# EasyEDA Pro project base_pcb.eprj

# Schematic Schematic1
Board Name: Board1; Create Date: 2026-06-29; Page Name: P1; Project Name: base_pcb; Schematic Name: Schematic1; Update Date: 2026-07-03; Company: EasyEDA.com; Page Size: A4; Version: V1.0
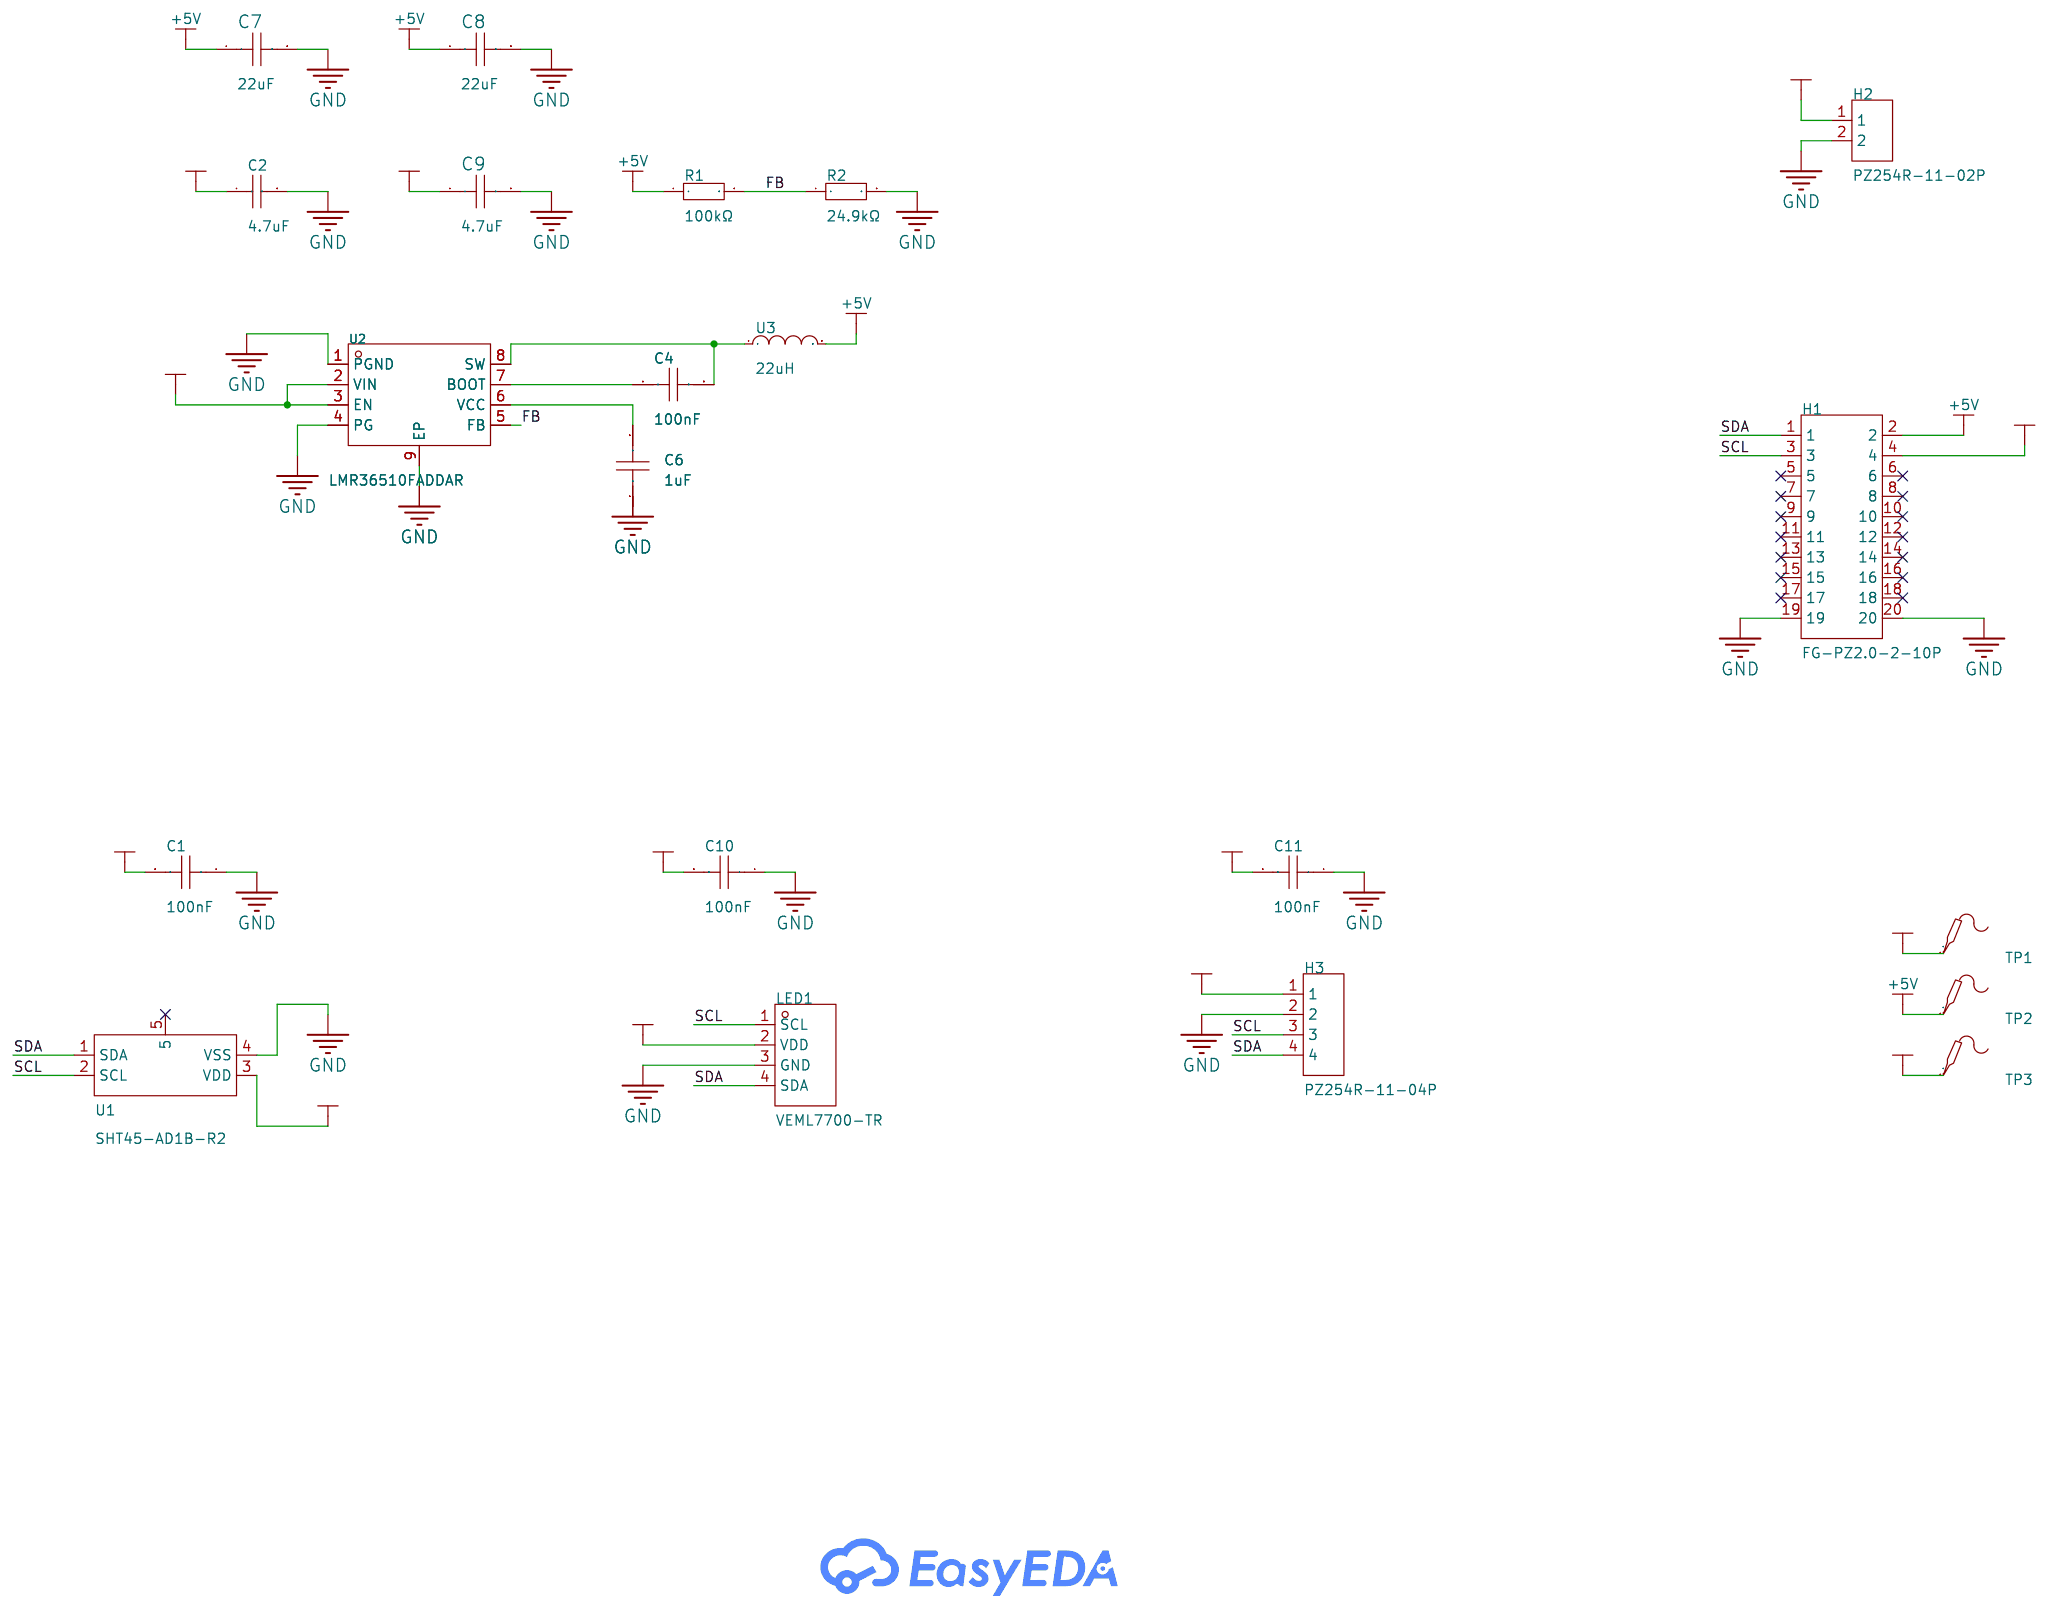
[diagram p0: schematic sheet]

## Parts
C1  100nF  [C0603]
C2  4.7uF  [C1206]
C4  100nF  [C0603]
C6  1uF  [C0603]
C7  22uF  [C1210]
C8  22uF  [C1210]
C9  4.7uF  [C1210]
C10  100nF  [C0603]
C11  100nF  [C0603]
H1  FG-PZ2.0-2-10P  [HDR-TH_20P-P2.00-V-M-R2-C10-S2.0]
H2  PZ254R-11-02P  [HDR-TH_2P-P2.54-H-M-W10.4]
H3  PZ254R-11-04P  [HDR-TH_4P-P2.54-H-M-W10.4]
LED1  VEML7700-TR  [LED-SMD_4P-L6.8-W2.4_VEML7700-TR]
R1  100kΩ  [R0603]
R2  24.9kΩ  [R0603]
TP1  -  [TESTPOINT-TH_TP_4]  (no BOM)
TP2  -  [TESTPOINT-TH_TP_4]  (no BOM)
TP3  -  [TESTPOINT-TH_TP_4]  (no BOM)
U1  SHT45-AD1B-R2  [DFN-4_L1.5-W1.5-P0.8-TL-EP]
U2  LMR36510FADDAR  [ESOP-8_L4.9-W3.9-P1.27-LS6.0-BL-EP-1]
U3  22uH  [IND-SMD_L7.1-W6.6]

## Library data of the parts
C1 C4 C10 C11 = CC0603KRX7R9BB104: Capacitance:100nF Tolerance:±10% Tolerance:±10% Voltage Rating:50V Temperature Coefficient:X7R; LCSC Part Name: 100nF ±10% 50V; Supplier Part: C14663; Manufacturer: YAGEO(国巨); Supplier Footprint: 0603; JLCPCB Part Class: Basic Part; Datasheet: https://item.szlcsc.com/datasheet/CC0603KRX7R9BB104/15331.html; Supplier: LCSC; Tolerance: ±10%; Voltage Rating: 50V; Temperature Coefficient: X7R
C2 = CL31B475KBHNNNE: Capacitance:4.7uF Tolerance:±10% Tolerance:±10% Voltage Rating:50V Temperature Coefficient:X7R; LCSC Part Name: 4.7uF ±10% 50V; Supplier Part: C51205; Manufacturer: SAMSUNG(三星); Supplier Footprint: 1206; JLCPCB Part Class: Extended Part; Datasheet: https://item.szlcsc.com/datasheet/CL31B475KBHNNNE/52218.html; Supplier: LCSC; Tolerance: ±10%; Voltage Rating: 50V; Temperature Coefficient: X7R
C6 = CL10A105KB8NNNC: Capacitance:1uF Tolerance:±10% Tolerance:±10% Voltage Rating:50V Temperature Coefficient:X5R; LCSC Part Name: 1uF ±10% 50V; Supplier Part: C15849; Manufacturer: SAMSUNG(三星); Supplier Footprint: 0603; JLCPCB Part Class: Basic Part; Datasheet: https://item.szlcsc.com/datasheet/CL10A105KB8NNNC/16531.html; Supplier: LCSC; Tolerance: ±10%; Voltage Rating: 50V; Temperature Coefficient: X5R
C7 C8 = GRM32ER71E226KE15L: Capacitance:22uF Tolerance:±10% Tolerance:±10% Voltage Rating:25V Temperature Coefficient:X7R; LCSC Part Name: 22uF ±10% 25V; Supplier Part: C21397; Manufacturer: muRata(村田); Supplier Footprint: 1210; JLCPCB Part Class: Extended Part; Datasheet: https://item.szlcsc.com/datasheet/GRM32ER71E226KE15L/22114.html; Supplier: LCSC; Tolerance: ±10%; Voltage Rating: 25V; Temperature Coefficient: X7R
C9 = GRM32ER71H475KA88L: Capacitance:4.7uF Tolerance:±10% Tolerance:±10% Voltage Rating:50V Temperature Coefficient:X7R; LCSC Part Name: 4.7uF ±10% 50V; Supplier Part: C86052; Manufacturer: muRata(村田); Supplier Footprint: 1210; JLCPCB Part Class: Extended Part; Datasheet: https://item.szlcsc.com/datasheet/GRM32ER71H475KA88L/87228.html; Supplier: LCSC; Tolerance: ±10%; Voltage Rating: 50V; Temperature Coefficient: X7R
H1 = FG-PZ2.0-2-10P: Pin Structure:2x10P Pitch:2mm Row Spacing:2mm Circluar Pins/Square Pins:Pin Header Mounting Type:Through Hole Number of Rows:2 Number of Pins:20P Length of Mating Pin:4mm Insulation Height:2mm Length of End Connection Pin:3mm Contact Material:Brass Contac; LCSC Part Name: 2x10P 间距:2mm 方针 直插; Supplier Part: C42416889; Manufacturer: FG(富港); Supplier Footprint: 插件,P=2mm; Datasheet: https://item.szlcsc.com/datasheet/FG-PZ2.0-2-10P/44419001.html; Supplier: LCSC; Pin Structure: 2x10P; Pitch: 2mm; Row Spacing: 2mm; Circluar Pins/Square Pins: Pin Header; Mounting Type: Through Hole; Number of Rows: 2; Number of Pins: 20P; Length of Mating Pin: 4mm; Insulation Height: 2mm; Length of End Connection Pin: 3mm; Contact Material: Brass; Contact Plating: Gold; Color: Black
H2 = PZ254R-11-02P: Pin Structure:1x2P Pitch:2.54mm Row Spacing:- Circluar Pins/Square Pins:Pin Header Mounting Type:Right Angle Number of Rows:1 Number of Pins:2P Current Rating:3A Voltage Rating (Max):250V Length of Mating Pin:6mm Insulation Height:2.5mm Length of End Conn; LCSC Part Name: 1x2P 间距:2.54mm 方针 弯插; Supplier Part: C492410; Manufacturer: XFCN(兴飞); Supplier Footprint: 弯插,P=2.54mm; JLCPCB Part Class: Extended Part; Datasheet: https://item.szlcsc.com/datasheet/PZ254R-11-02P/502966.html; Supplier: LCSC; Pin Structure: 1x2P; Pitch: 2.54mm; Circluar Pins/Square Pins: Pin Header; Mounting Type: Right Angle; Number of Rows: 1; Number of Pins: 2P; Current Rating: 3A; Voltage Rating (Max): 250V; Length of Mating Pin: 6mm; Insulation Height: 2.5mm; Contact Material: Brass; Operating Temperature: -40℃~+105℃; Color: Black
H3 = PZ254R-11-04P: LCSC Part Name: 1x4P 间距:2.54mm 方针 弯插; Supplier Part: C492412; Manufacturer: XFCN(兴飞); Supplier Footprint: 弯插,P=2.54mm; JLCPCB Part Class: Extended Part; Datasheet: https://item.szlcsc.com/datasheet/PZ254R-11-04P/502968.html; Supplier: LCSC; Pin Structure: 1x4P; Pitch: 2.54mm; Circluar Pins/Square Pins: Pin Header; Mounting Type: Right Angle; Number of Rows: 1; Number of Pins: 4P; Current Rating: 3A; Voltage Rating (Max): 250V; Length of Mating Pin: 6mm; Insulation Height: 2.5mm; Contact Material: Brass; Operating Temperature: -40℃~+105℃; Color: Black
LED1 = VEML7700-TR: LCSC Part Name: I2C接口的高精度环境光传感器; Supplier Part: C504893; Manufacturer: VISHAY(威世); Supplier Footprint: SMD-4P; JLCPCB Part Class: Extended Part; Datasheet: https://item.szlcsc.com/datasheet/VEML7700-TR/519982.html; Supplier: LCSC; Measurement Type: Light Intensity; Photoperceptivity: 120klx; Interface: I2C; Resolution(Bits): 16bit; Voltage - Supply: 2.5V~3.6V; Operating Temperature: -25℃~+85℃; Length: 6.8mm; Width: 2.35mm; Height: 3mm
R1 = 0603WAF1003T5E: Type:Thick Film Resistor Resistance:100kΩ Tolerance:±1% Tolerance:±1% Power(Watts):100mW Voltage-Supply(Max):75V Temperature Coefficient:±100ppm/℃ Temperature Coefficient:±100ppm/℃ Operating Temperature:-55℃~+155℃ Operating Temperature:-55℃~+155℃; LCSC Part Name: 100kΩ ±1% 100mW 厚膜电阻; Supplier Part: C25803; Manufacturer: UNI-ROYAL(厚声); Supplier Footprint: 0603; JLCPCB Part Class: Basic Part; Datasheet: https://item.szlcsc.com/datasheet/0603WAF1003T5E/26546.html; Supplier: LCSC; Type: Thick Film Resistor; Tolerance: ±1%; Power(Watts): 100mW; Voltage-Supply(Max): 75V; Temperature Coefficient: ±100ppm/℃; Operating Temperature: -55℃~+155℃
R2 = 0603WAF2492T5E: Type:Thick Film Resistor Resistance:24.9kΩ Tolerance:±1% Tolerance:±1% Power(Watts):100mW Voltage-Supply(Max):75V Temperature Coefficient:±100ppm/℃ Temperature Coefficient:±100ppm/℃ Operating Temperature:-55℃~+155℃ Operating Temperature:-55℃~+155℃; LCSC Part Name: 24.9kΩ ±1% 100mW 厚膜电阻; Supplier Part: C25962; Manufacturer: UNI-ROYAL(厚声); Supplier Footprint: 0603; JLCPCB Part Class: Extended Part; Datasheet: https://item.szlcsc.com/datasheet/0603WAF2492T5E/26705.html; Supplier: LCSC; Type: Thick Film Resistor; Tolerance: ±1%; Power(Watts): 100mW; Voltage-Supply(Max): 75V; Temperature Coefficient: ±100ppm/℃; Operating Temperature: -55℃~+155℃
TP1-TP3 = Test-Point: Check: false
U1 = SHT45-AD1B-R2: Detection Temperature Range:-40℃~+125℃ Detection Temperature Range:-40℃~+125℃ Tolerance:±0.1℃ Tolerance:±0.1℃ Voltage - Supply:1.08V~3.6V Voltage - Supply:1.08V~3.6V Standby Current:1uA Interface:I2C Temperature Conversion Time:8.3ms Temperature Resolutio; LCSC Part Name: 3.000.645 3.000.645 ±1.0% RH / ±0.1 °C 的数字式温湿度传感器; Supplier Part: C5221601; Manufacturer: Sensirion(瑞士盛思锐); Supplier Footprint: DFN-4(1.5x1.5); JLCPCB Part Class: Extended Part; Datasheet: https://item.szlcsc.com/datasheet/SHT45-AD1B-R2/5920594.html; Supplier: LCSC; Detection Temperature Range: -40℃~+125℃; Tolerance: ±0.1℃; Voltage - Supply: 1.08V~3.6V; Standby Current: 1uA; Interface: I2C; Temperature Conversion Time: 8.3ms; Temperature Resolution: 16bit; Features: Factory temperature calibration
U2 = LMR36510FADDAR: Function:Step-down type Voltage - Supply:4.2V~65V Voltage - Supply:4.2V~65V Output Voltage:1V~28V Output Voltage:1V~28V Output Current:1A Frequency - Switching:400kHz Frequency - Switching:400kHz Operating Temperature:-40℃~+125℃@(TJ) Operating Temperature; LCSC Part Name: 降压型 1A 4.2V~65V; Supplier Part: C1858394; Manufacturer: TI(德州仪器); Supplier Footprint: ESOP-8; JLCPCB Part Class: Extended Part; Datasheet: https://www.ti.com/cn/lit/ds/symlink/lmr36510.pdf; Supplier: LCSC; Function: Step-down type; Voltage - Supply: 4.2V~65V; Output Voltage: 1V~28V; Output Current: 1A; Frequency - Switching: 400kHz; Operating Temperature: -40℃~+125℃@(TJ); Synchronous Rectifier: Yes; Number of Outputs: 1; Topology: Buck; Quiescent Current: 26uA; Switch tube (built-in/external): Built-in; Output Type: Adjustable; Features: Light load efficient mode；Built-in LDO regulator；Cycle-by-cycle current limiting；Operating status indication；Hiccup current limiting
U3 = APH0630T220M: Inductance:22uH Tolerance:±20% Tolerance:±20% Current Rating:2.5A Current - Saturation(Isat):3A DC Resistance(DCR):170mΩ Type:Molded Inductor Ratings:-; LCSC Part Name: 22uH ±20% 3A; Supplier Part: C5349702; Manufacturer: APV(爱普微); Supplier Footprint: SMD,7x6.6mm; JLCPCB Part Class: Extended Part; Datasheet: https://item.szlcsc.com/datasheet/APH0630T220M/6135117.html; Supplier: LCSC; Tolerance: ±20%; Current Rating: 2.5A; Current - Saturation(Isat): 3A; DC Resistance(DCR): 170mΩ; Type: Molded Inductor

## Nets
3V3: C1.2 C10.2 C11.2 H1.4 H3.1 LED1.2(VDD) TP3.1 U1.3(VDD)
+5V: C7.1 C8.1 H1.2 R1.1 TP2.1 U3.2
+24V: C2.1 C9.1 H2.1 TP1.1 U2.2(VIN) U2.3(EN)
GND: C1.1 C2.2 C6.1 C7.2 C8.2 C9.2 C10.1 C11.1 H1.19 H1.20 H2.2 H3.2 LED1.3(GND) R2.2 U1.4(VSS) U2.1(PGND) U2.4(PG) U2.9(EP)
FB: R1.2 R2.1 U2.5(FB)
SCL: H1.3 H3.3 LED1.1(SCL) U1.2(SCL)
SDA: H1.1 H3.4 LED1.4(SDA) U1.1(SDA)
$1N2931: C4.2 U2.8(SW) U3.1
$1N3165: C4.1 U2.7(BOOT)
$1N3213: C6.2 U2.6(VCC)

Not connected (* = marked no-connect by the designer): H1 5* 6* 7* 8* 9* 10* 11* 12* 13* 14* 15* 16* 17* 18*; U1 5*

# Board PCB1
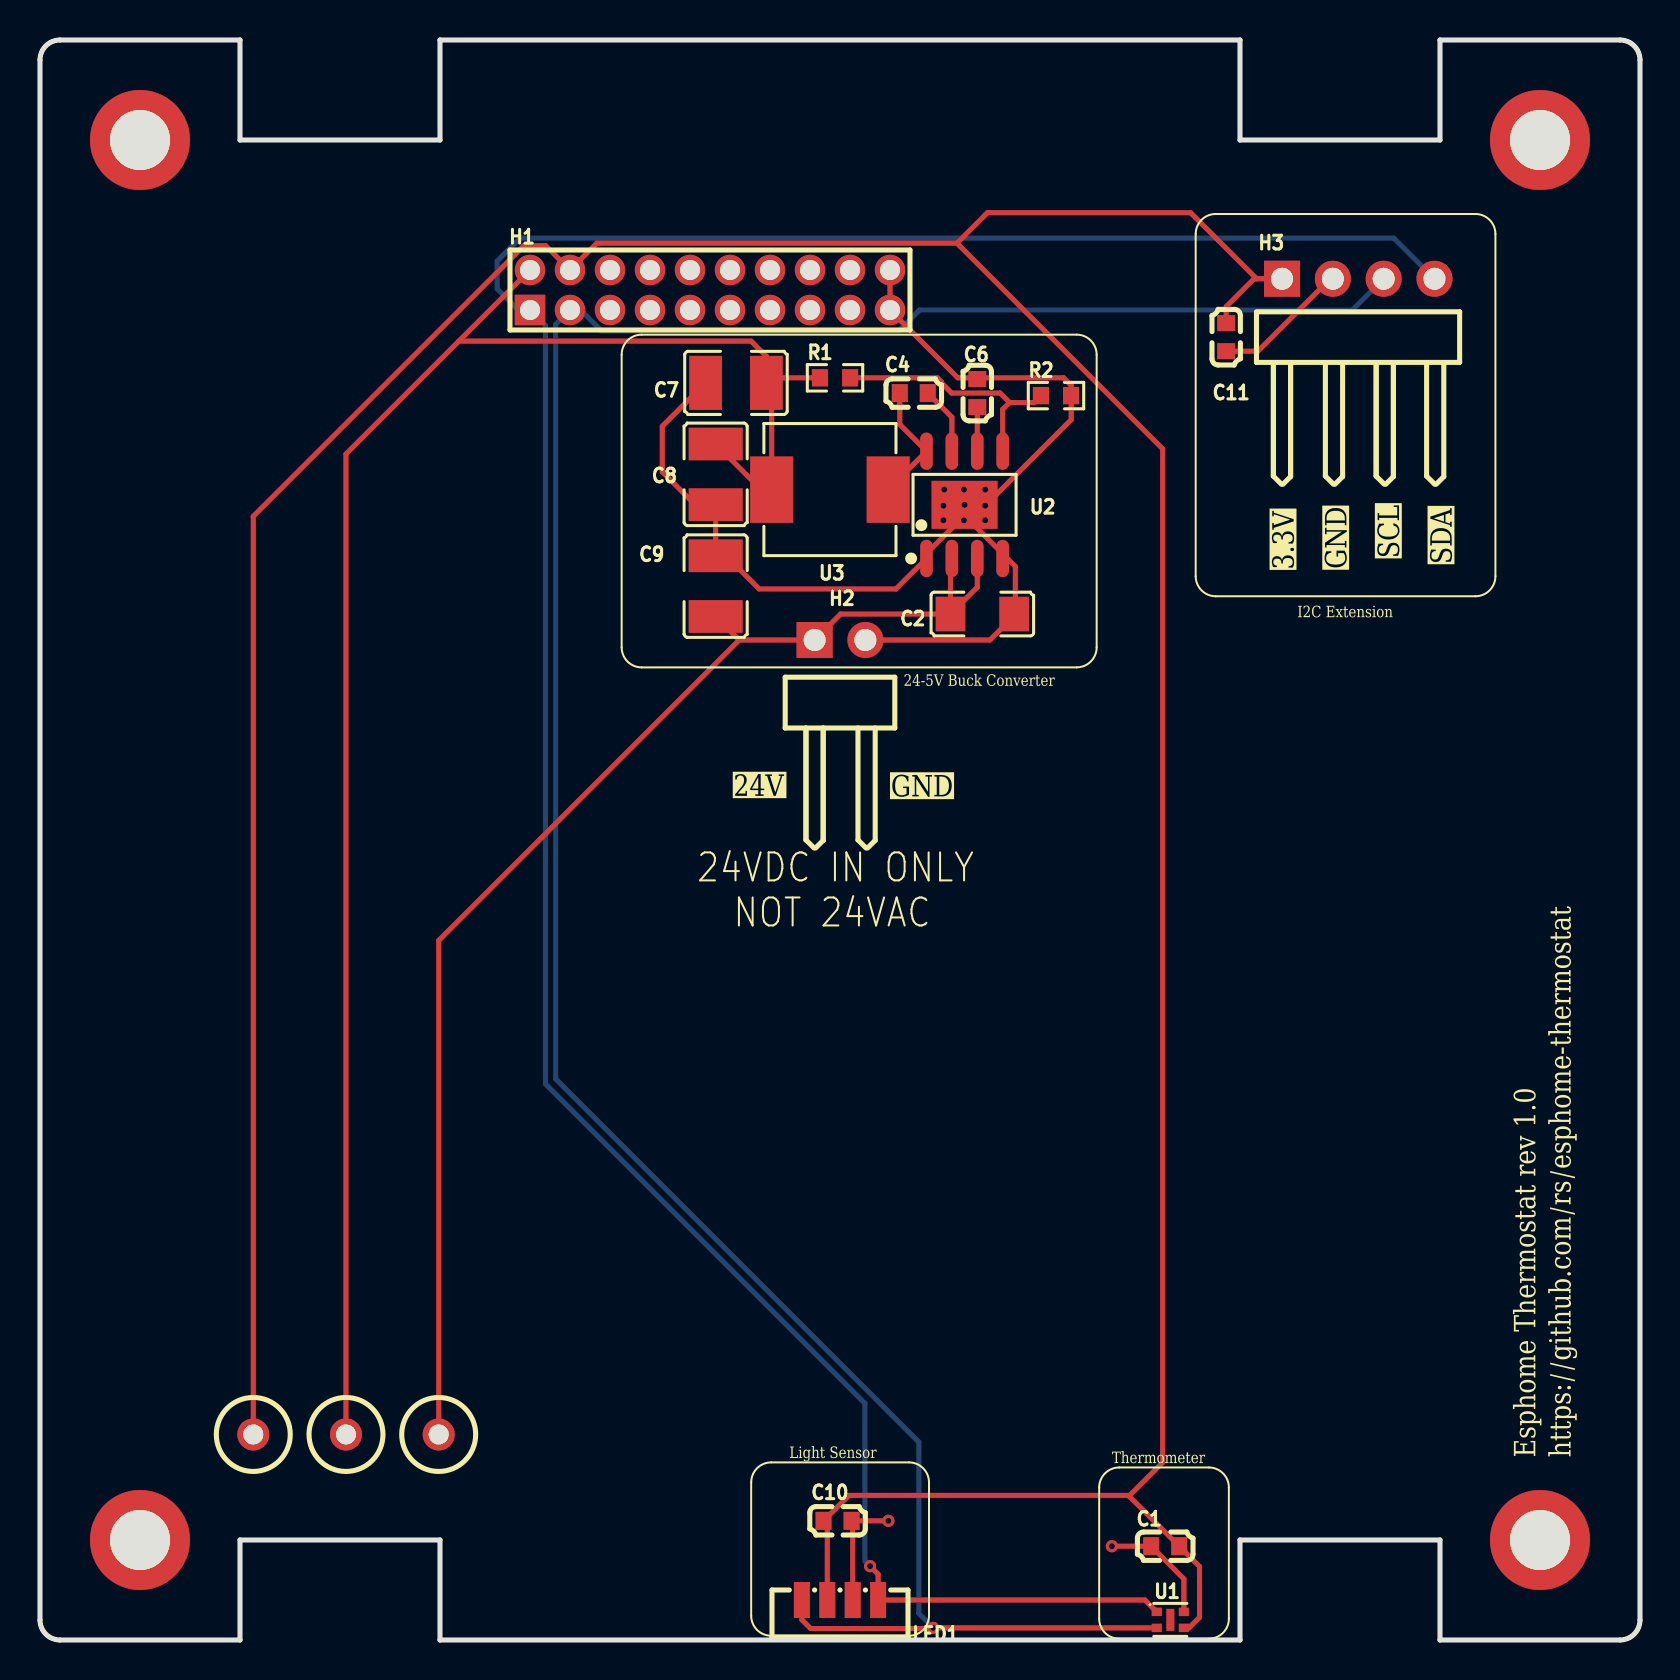
[diagram p1: board, top side]
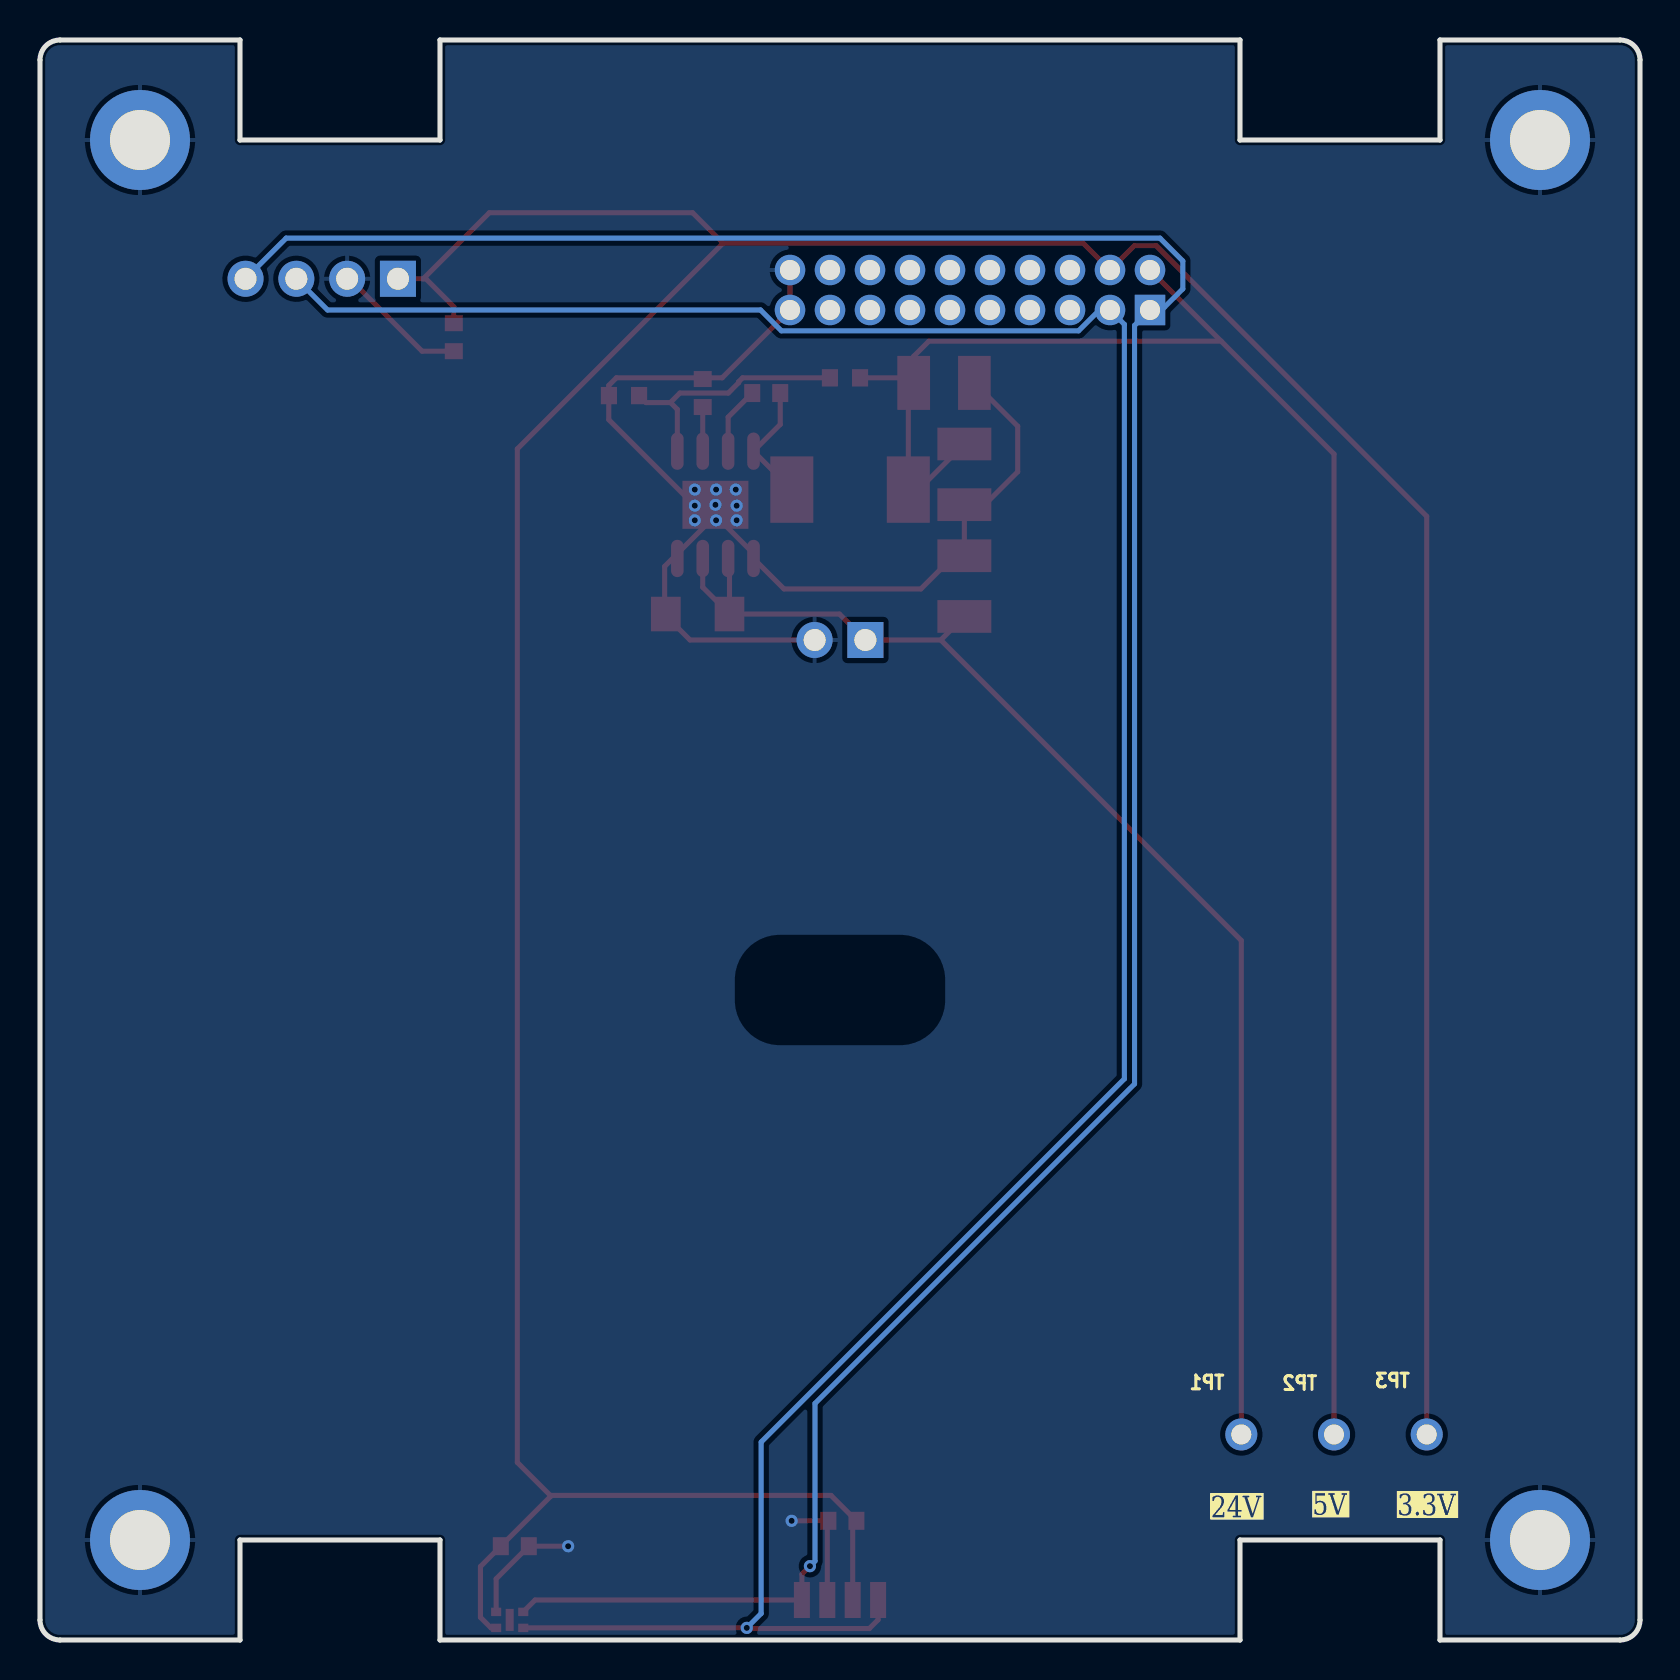
[diagram p2: board, bottom side, seen from below]

Outline 80 x 80 mm; copper layers: Top Layer, Bottom Layer. Coordinates in mm from the lower left corner of the outline.
Outline path: 0,79 0,1 arc(0.29,0.29) 1,0 10,0 10,5 20,5 20,0 60,0 60,5 70,5 70,0 79,0 arc(79.71,0.29) 80,1 80,79 arc(79.71,79.71) 79,80 70,80 70,75 60,75 60,80 20,80 20,75 10,75 10,80 1,80 arc(0.29,79.71) 0,79
Stack: Top Layer 0.035mm / Dielectric1 1.51mm FR4 er 4.5 / Bottom Layer 0.035mm

## Design rules (mm)
template: JLCPCB Capability(Two Layers Board)
spacing copperThickness1oz (default): track to track 0.102, other pairs 0.152 to 0.3
spacing copperThickness2oz: track to track 0.203, other pairs 0.152 to 0.3
track width copperThickness1oz (default): min 0.127, default 0.254, max 2.54
track width copperThickness2oz: min 0.203, default 0.254, max 2.54
differential pair differentialPair (default): width min 0.127, default 0.254, max 2.54; gap min 0.152, default 0.152
via viaSize (default): diameter min 0.5, default 0.61, max 10; hole min 0.3, default 0.305, max 6.3

## Placement (name value [footprint] x y rotation side)
C1  100nF  [C0603]  56.26 4.69 0 top
C2  4.7uF  [C1206]  47.12 51.3 0 top
C4  100nF  [C0603]  43.69 62.35 180 top
C6  1uF  [C0603]  46.86 62.35 270 top
C7  22uF  [C1210]  34.8 62.86 180 top
C8  22uF  [C1210]  33.78 58.28 270 top
C9  4.7uF  [C1210]  33.78 52.69 90 top
C10  100nF  [C0603]  39.88 5.96 180 top
C11  100nF  [C0603]  59.31 65.14 90 top
H1  FG-PZ2.0-2-10P  [HDR-TH_20P-P2.00-V-M-R2-C10-S2.0]  33.5 67.5 0 top
H2  PZ254R-11-02P  [HDR-TH_2P-P2.54-H-M-W10.4]  40 50 0 top
H3  PZ254R-11-04P  [HDR-TH_4P-P2.54-H-M-W10.4]  65.91 68.06 0 top
LED1  VEML7700-TR  [LED-SMD_4P-L6.8-W2.4_VEML7700-TR]  40 2 180 top
NOREF  -  [Pad_e835]  75 5 0 top
NOREF#2  -  [Pad_e836]  75 75 0 top
NOREF#3  -  [Pad_e832]  5 75 0 top
NOREF#4  -  [Pad_e834]  5 5 0 top
R1  100kΩ  [R0603]  39.75 63.11 0 top
R2  24.9kΩ  [R0603]  50.8 62.22 0 top
TP1  -  [TESTPOINT-TH_TP_4]  19.94 10.28 0 top
TP2  -  [TESTPOINT-TH_TP_4]  15.3 10.28 0 top
TP3  -  [TESTPOINT-TH_TP_4]  10.66 10.28 0 top
U1  SHT45-AD1B-R2  [DFN-4_L1.5-W1.5-P0.8-TL-EP]  56.51 1.01 0 top
U2  LMR36510FADDAR  [ESOP-8_L4.9-W3.9-P1.27-LS6.0-BL-EP-1]  46.23 56.76 0 top
U3  22uH  [IND-SMD_L7.1-W6.6]  39.5 57.52 180 top

## Footprints (pads in the part's own frame, mm; a bottom-side part is the same pattern mirrored in y, then rotated)
C0603
  rect 0.8x0.9 smd: 1(-0.7,0) 2(0.7,0)
C1206
  rect 1.485x1.728 smd: 1(-1.593,0) 2(1.593,0)
C1210
  rect 1.635x2.7 smd: 1(-1.518,0) 2(1.518,0)
DFN-4_L1.5-W1.5-P0.8-TL-EP
  rect 0.505x0.42 smd: 1(-0.677,0.4) 2(-0.677,-0.4) 3(0.677,-0.4) 4(0.677,0.4)
  rect 0.4x1.1 smd: 5(0,0)
ESOP-8_L4.9-W3.9-P1.27-LS6.0-BL-EP-1
  oval 0.63x1.865 smd: 1(-1.905,-2.683) 2(-0.635,-2.683) 3(0.635,-2.683) 4(1.905,-2.683) 5(1.905,2.683) 6(0.635,2.683) 7(-0.635,2.683) 8(-1.905,2.683)
  rect 3.3x2.4 smd: 9(0,0)
HDR-TH_2P-P2.54-H-M-W10.4
  rect 1.8x1.8 hole 1.1: 1(-1.27,0)
  round 1.8 hole 1.1: 2(1.27,0)
HDR-TH_4P-P2.54-H-M-W10.4
  rect 1.8x1.8 hole 1.1: 1(-3.81,0)
  round 1.8 hole 1.1: 2(-1.27,0) 3(1.27,0) 4(3.81,0)
HDR-TH_20P-P2.00-V-M-R2-C10-S2.0
  rect 1.524x1.524 hole 1: 1(-9,-1)
  round 1.524 hole 1: 2(-9,1) 3(-7,-1) 4(-7,1) 5(-5,-1) 6(-5,1) 7(-3,-1) 8(-3,1) 9(-1,-1) 10(-1,1) 11(1,-1) 12(1,1) 13(3,-1) 14(3,1) 15(5,-1) 16(5,1) 17(7,-1) 18(7,1) 19(9,-1) 20(9,1)
IND-SMD_L7.1-W6.6
  rect 2.15x3.32 smd: 1(-2.913,0) 2(2.913,0)
LED-SMD_4P-L6.8-W2.4_VEML7700-TR
  rect 0.8x1.8 smd: 1(1.905,0) 2(0.635,0) 3(-0.635,0) 4(-1.905,0)
Pad_e832
  round 5 hole 3: 1(0,0)
Pad_e834
  round 5 hole 3: 1(0,0)
Pad_e835
  round 5 hole 3: 1(0,0)
Pad_e836
  round 5 hole 3: 1(0,0)
R0603
  rect 0.806x0.864 smd: 1(-0.753,0) 2(0.753,0)
TESTPOINT-TH_TP_4
  round 1.6 hole 1: 1(0,0)

## Nets
As in the schematic, except:
GND: C1.1 C2.2 C6.1 C7.2 C8.2 C9.2 C10.1 C11.1 H1.19 H1.20 H2.2 H3.2 LED1.3 NOREF.1 NOREF#2.1 NOREF#3.1 NOREF#4.1 R2.2 U1.4 U2.1 U2.4 U2.9

Pads without a net: H1 5 6 7 8 9 10 11 12 13 14 15 16 17 18; U1 5

## Via types
v1: diameter 0.61, hole 0.305, Top Layer to Bottom Layer, 13 vias

## Routing (per net, layer and track width the routed paths; a pad name or vN(x,y) marks a point on that pad's centre or on a via; arc(x,y) is an arc through that point)
3V3: length 205.6
  Top Layer w0.254: 60.83,68.06 60.71,68.06 59.31,66.67 59.31,65.84 ; 60.83,68.06 57.53,71.36 47.37,71.36 45.85,69.84 ; 60.83,68.06 H3.1 ; 45.85,69.84 27.84,69.84 H1.4 25.29,69.71 24.19,69.71 10.66,56.19 TP3.1 ; 45.85,69.84 56.13,59.55 56.13,8.88 54.45,7.2 ; 39.37,1.3 39.37,5.77 C10.2 40.45,7.23 54.42,7.23 54.45,7.2 ; 54.45,7.2 C1.2 57.98,3.67 57.98,1.13 57.45,0.61 U1.3
+5V: length 90.2
  Top Layer w0.254: 20.94,64.94 15.3,59.3 TP2.1 ; 20.94,64.94 H1.2 ; 20.94,64.94 35.55,64.94 36.32,64.18 C7.1 ; 36.57,63.11 R1.1 ; 36.58,62.47 U3.2 36.06,57.52 C8.1
+24V: length 64.8
  Top Layer w0.254: 34.96,50 C9.1 ; 34.96,50 H2.1 40.03,51.3 C2.1 ; 34.96,50 19.94,34.98 TP1.1 ; U2.3 46.86,52.64 C2.1 ; C2.1 45.52,54.01
GND: length 79.2
  Top Layer w0.254: v1(47.26,56.72) 51.56,61.02 51.56,62.73 51.18,63.11 45.89,63.11 H1.19 H1.20 ; U1.4 57.19,3.06 C1.1 v1(53.59,4.69) ; U2.1 42.8,52.55 35.96,52.55 34.3,54.21 C9.2 C8.2 32.76,56.77 31.12,58.41 31.12,60.69 C7.2 ; C11.1 60.9,64.44 64.52,68.06 H3.2 ; 40.63,5.9 40.63,1.3 ; H2.2 47.5,50 48.77,51.27 48.77,53.68 46.58,55.87 45.87,55.87 44.32,54.32 ; C10.1 v1(42.42,5.96)
  vias: v1(45.21,57.52) v1(45.17,56.72) v1(45.17,55.99) v1(46.19,57.52) v1(46.23,56.76) v1(46.19,55.99) v1(47.26,57.52) v1(47.26,55.99)
FB: length 12.8
  Top Layer w0.254: U2.5 48.13,61.53 48.47,61.87 ; R2.1 49.7,61.87 48.47,61.87 ; R1.2 44.87,63.11 45.07,62.91 45.07,62.86 45.58,62.35 48.01,62.35 48.47,61.88 48.47,61.87
SCL: length 135.1
  Top Layer w0.254: LED1.1 38.09,1.01 38.53,0.57 44.63,0.57 v1(44.66,0.61) U1.2
  Bottom Layer w0.254: H3.3 65.62,66.5 43.97,66.5 42.93,65.46 28.07,65.46 27.03,66.5 H1.3 25.78,65.78 25.78,28.06 43.94,9.9 43.94,1.33 v1(44.66,0.61)
SDA: length 137.5
  Top Layer w0.254: v1(41.5,3.69) 41.91,3.29 LED1.4 55.24,2 U1.1
  Bottom Layer w0.254: v1(41.5,3.69) 41.25,3.95 41.25,11.83 25.27,27.8 25.27,65.73 H1.1 23.91,66.5 22.86,67.55 22.86,68.95 24,70.09 67.69,70.09 H3.4
$1N2931: length 6.2
  Top Layer w0.254: C4.2 42.99,60.78 U2.8 44.32,59.43 U3.1
$1N3165: length 3.4
  Top Layer w0.254: C4.1 45.59,61.14 45.59,59.44
$1N3213: length 2.2
  Top Layer w0.254: 46.86,61.65 U2.6

## Copper pours and planes (outline as drawn; the poured copper is in the pictures)
GND on Bottom Layer: 0,80 80,80 80,0 0,0

## Text on the board
Bottom Silkscreen Layer: 3.3V | 5V | 24V
Top Silkscreen Layer: 24VDC IN ONLY / NOT 24VAC | Light Sensor | 24-5V Buck Converter | Thermometer | I2C Extension | 24V | GND | 3.3V | SCL | SDA | Esphome Thermostat rev 1.0 / https://github.com/rs/esphome-thermostat
